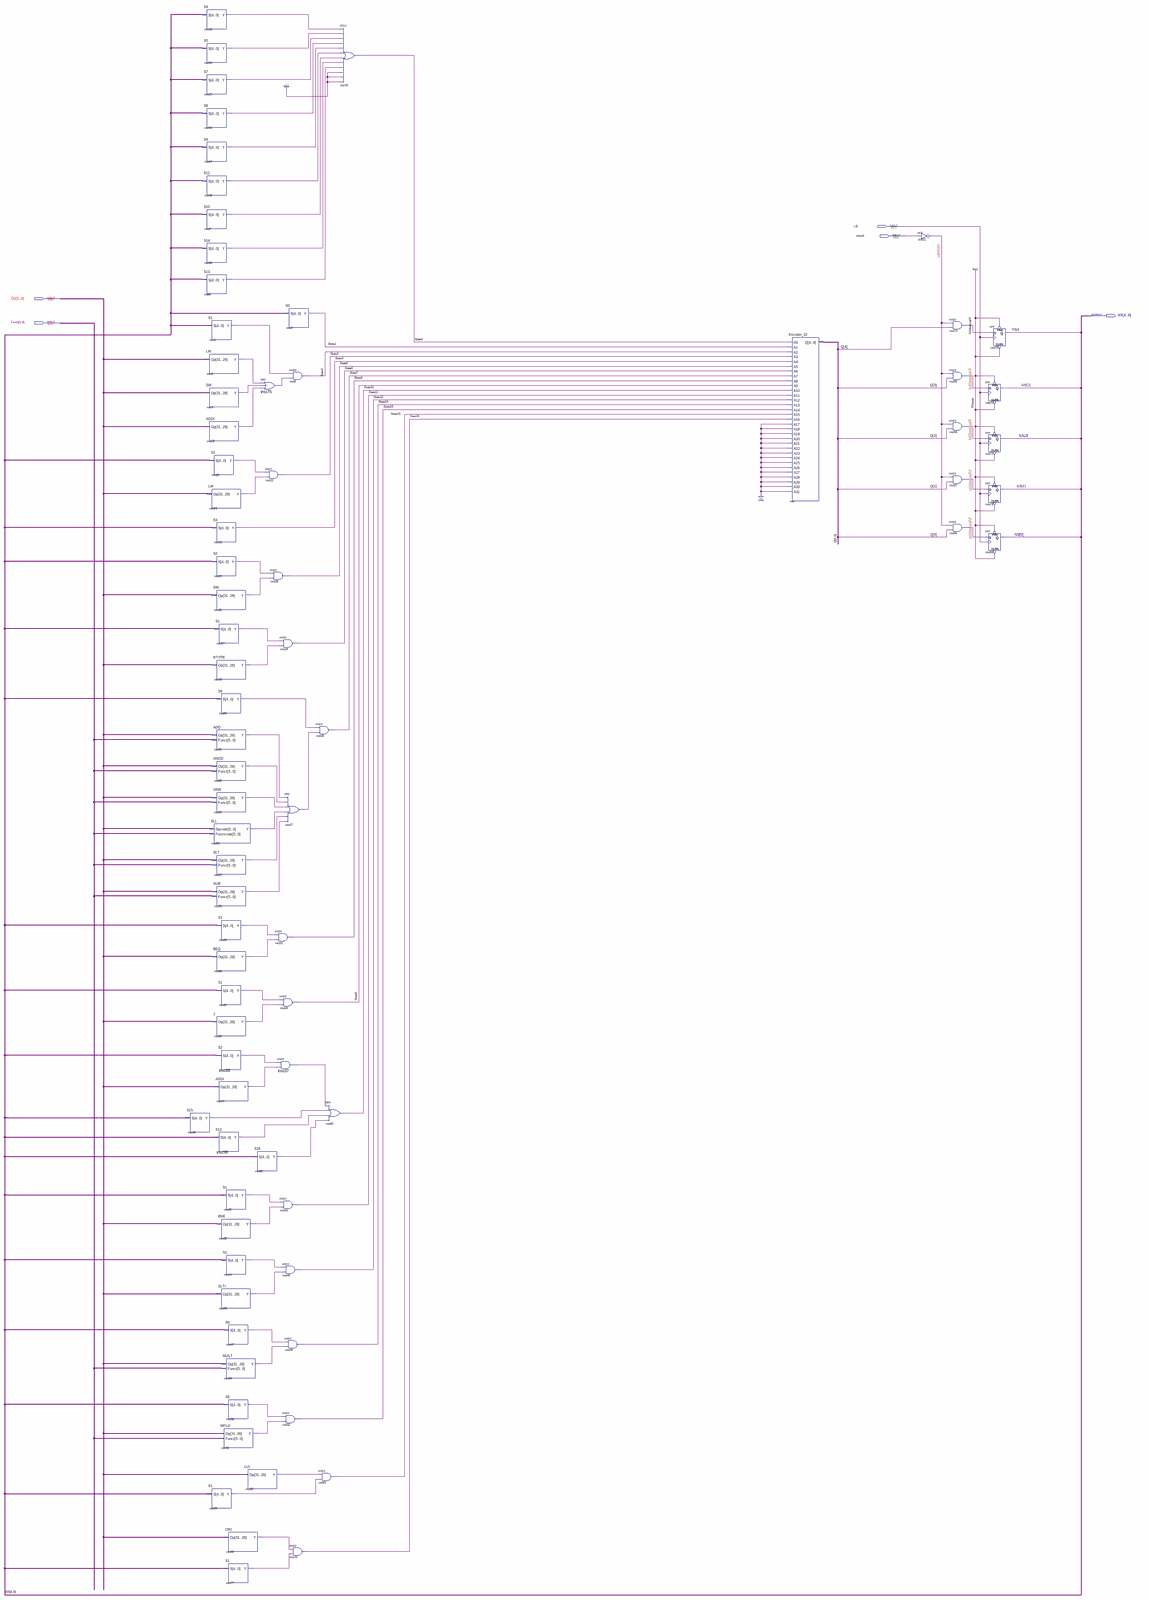
[diagram p0: schematic sheet, whole]
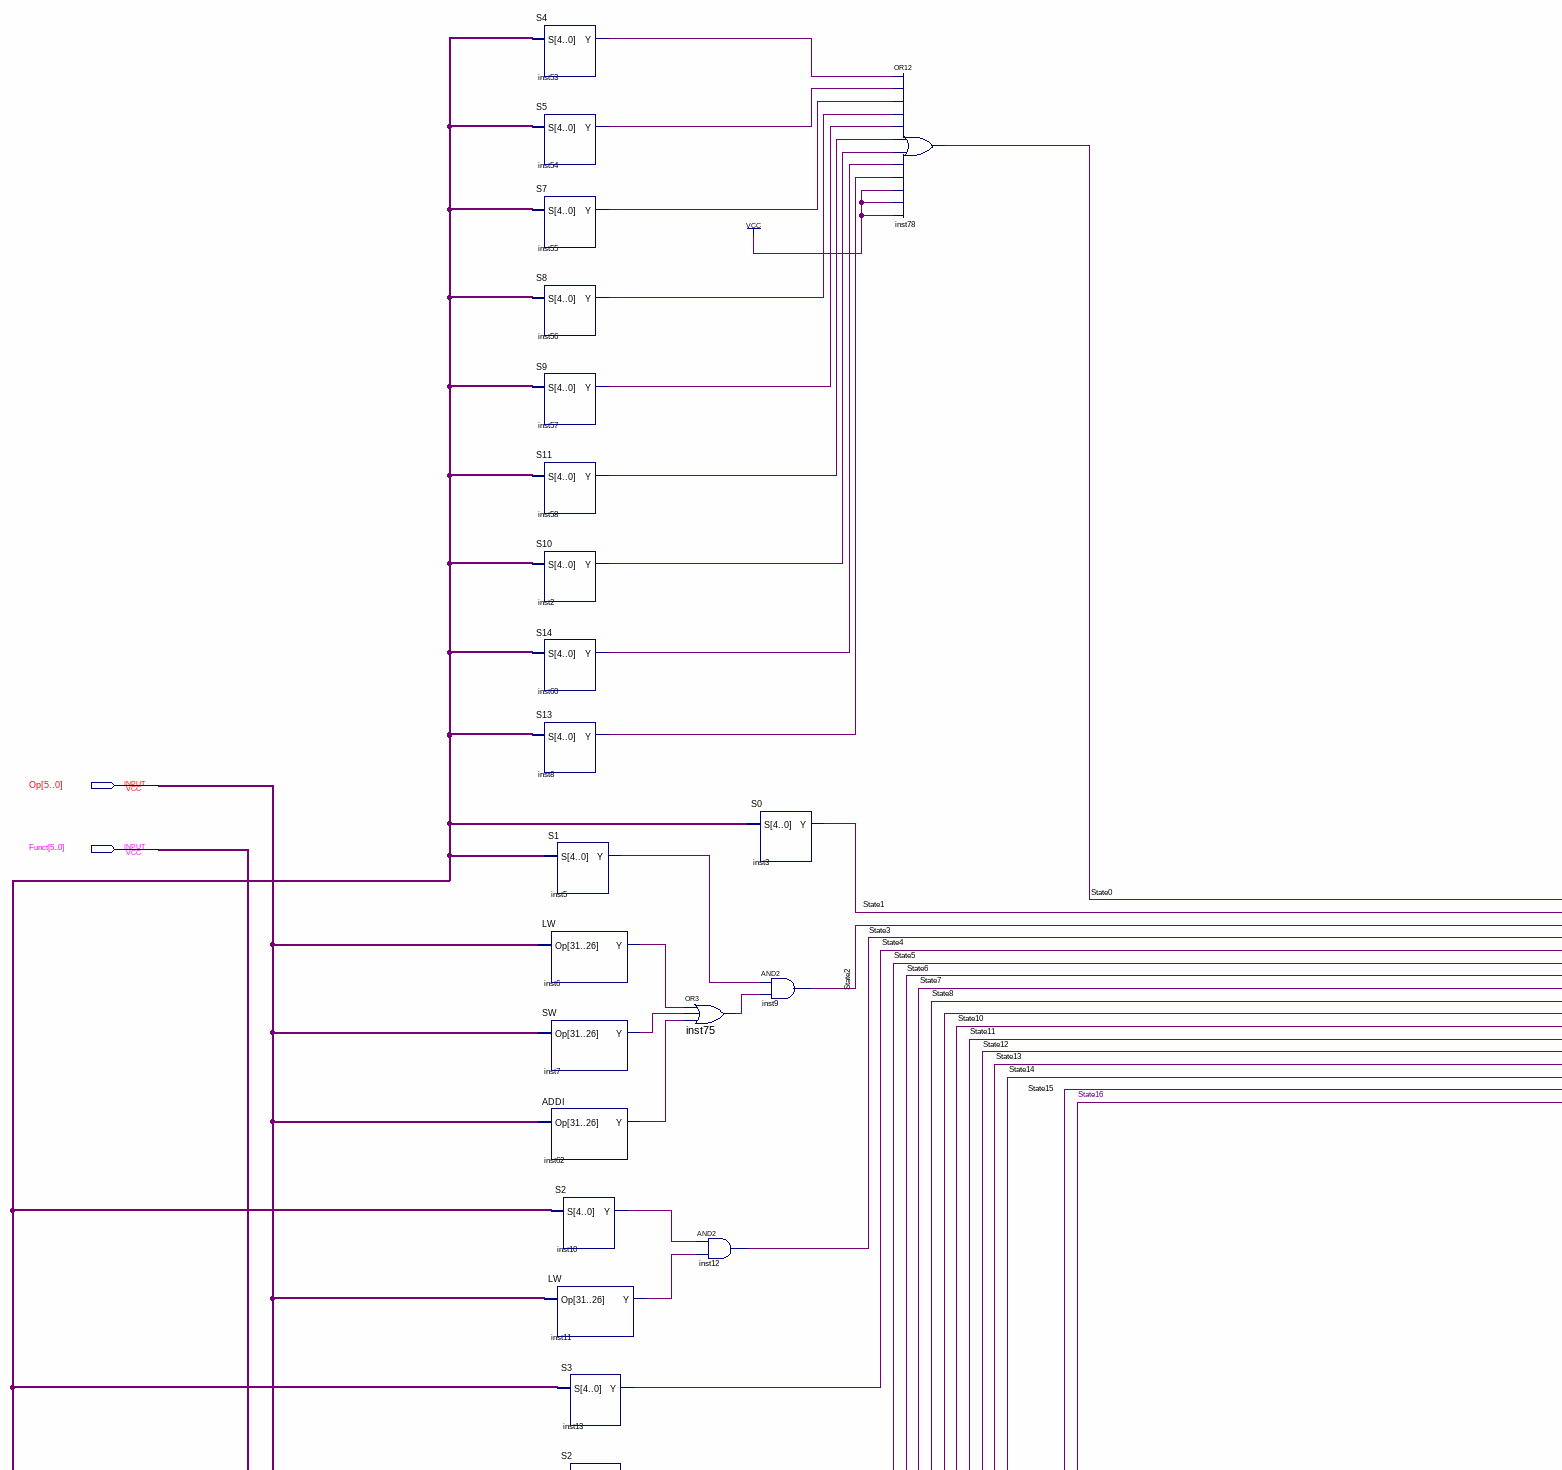
[diagram p1: schematic sheet, upper left part]
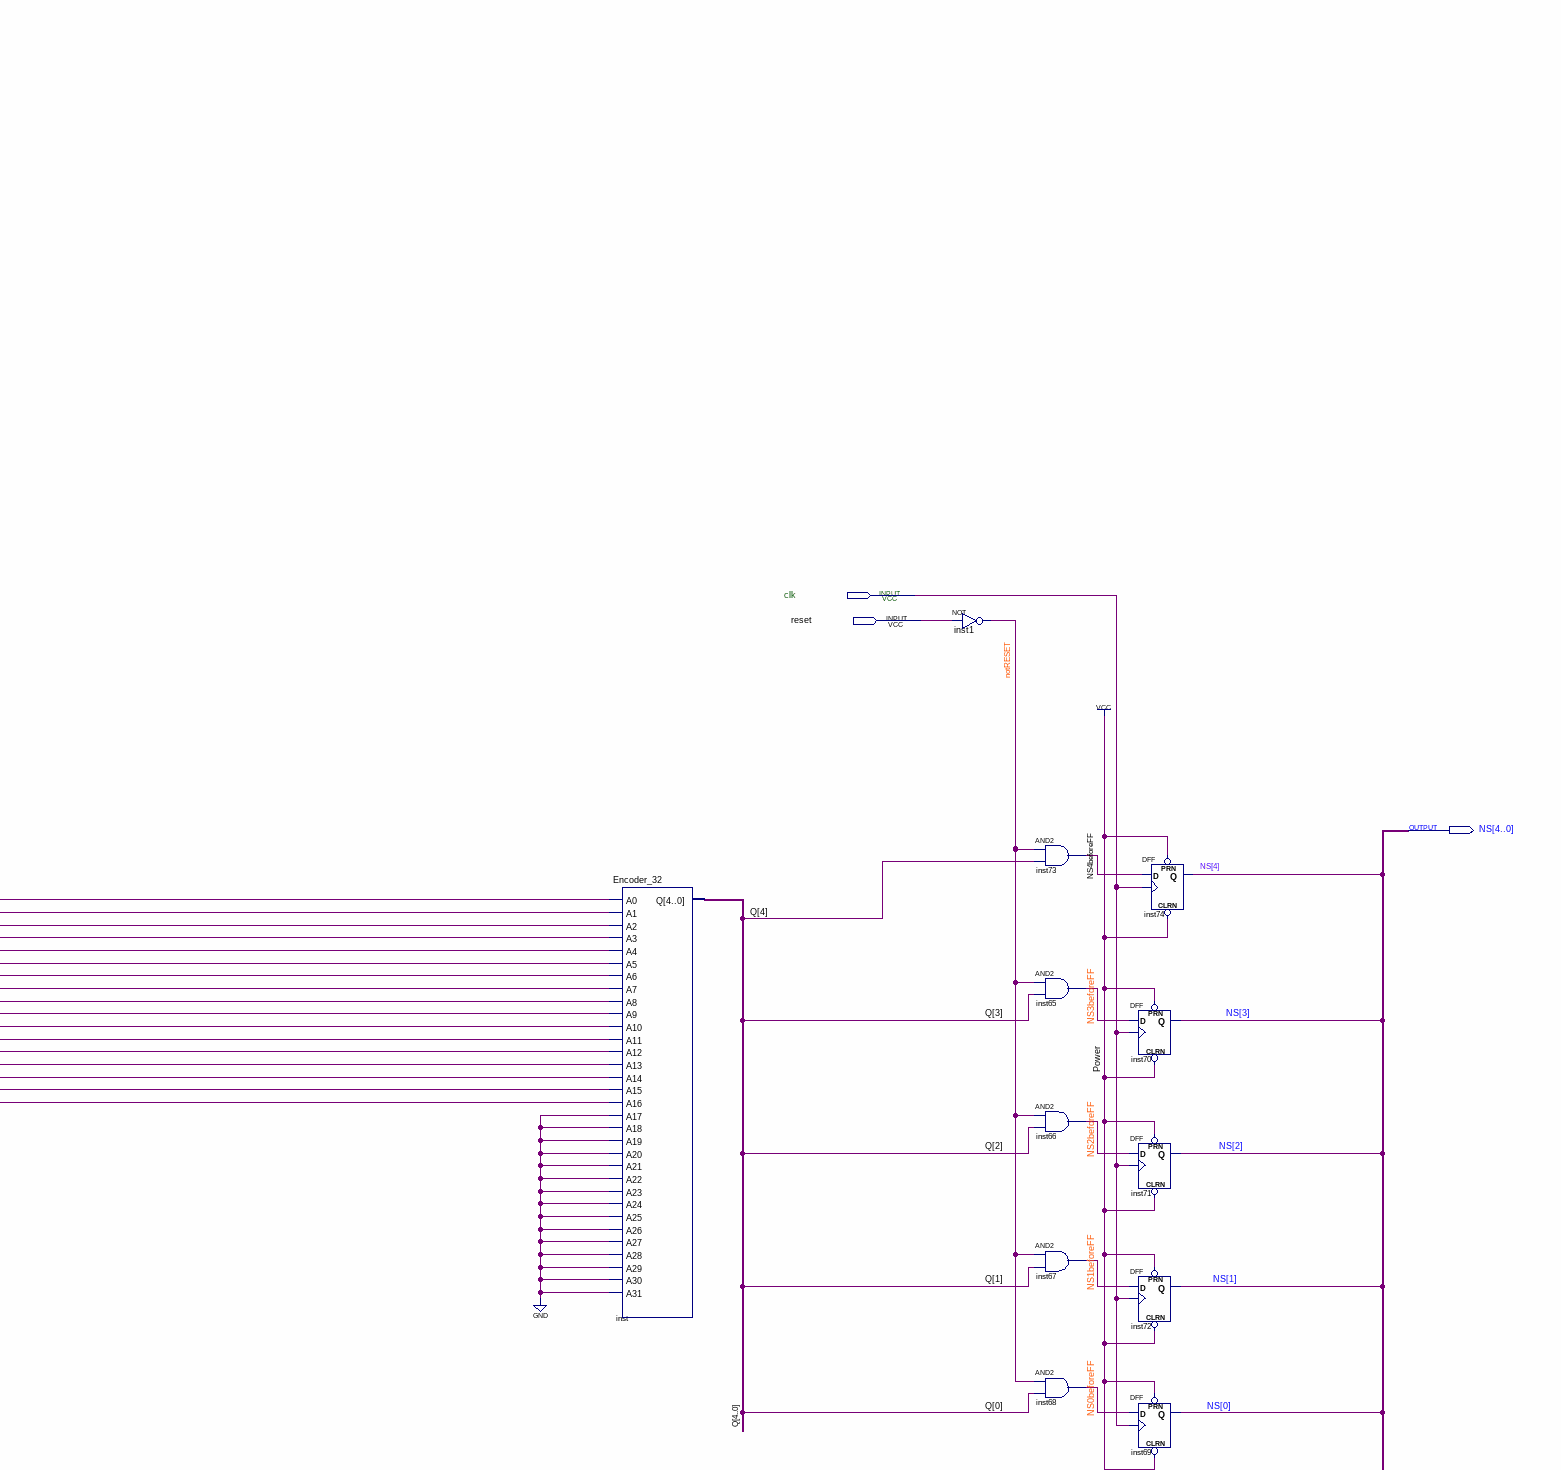
[diagram p2: schematic sheet, upper right part]
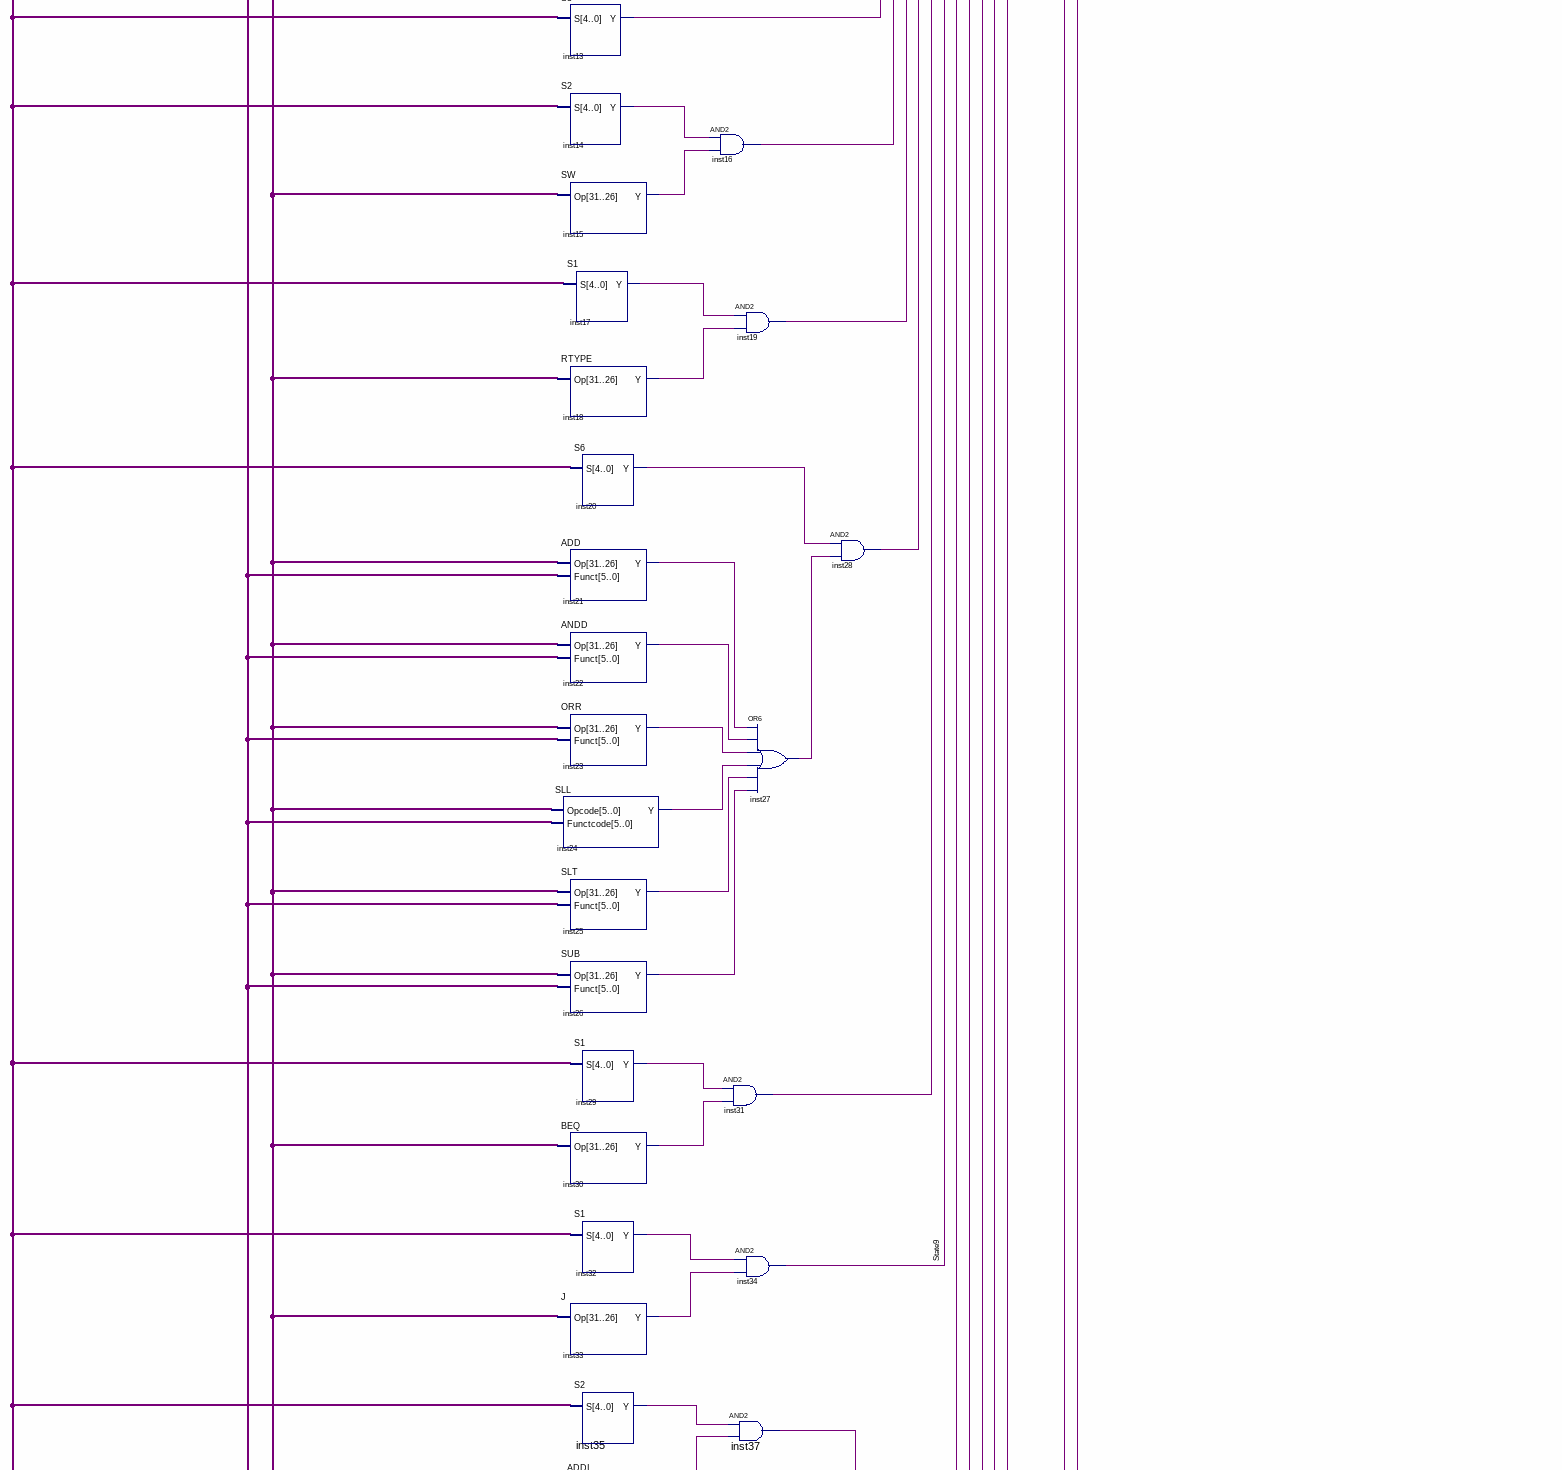
[diagram p3: schematic sheet, middle left part]
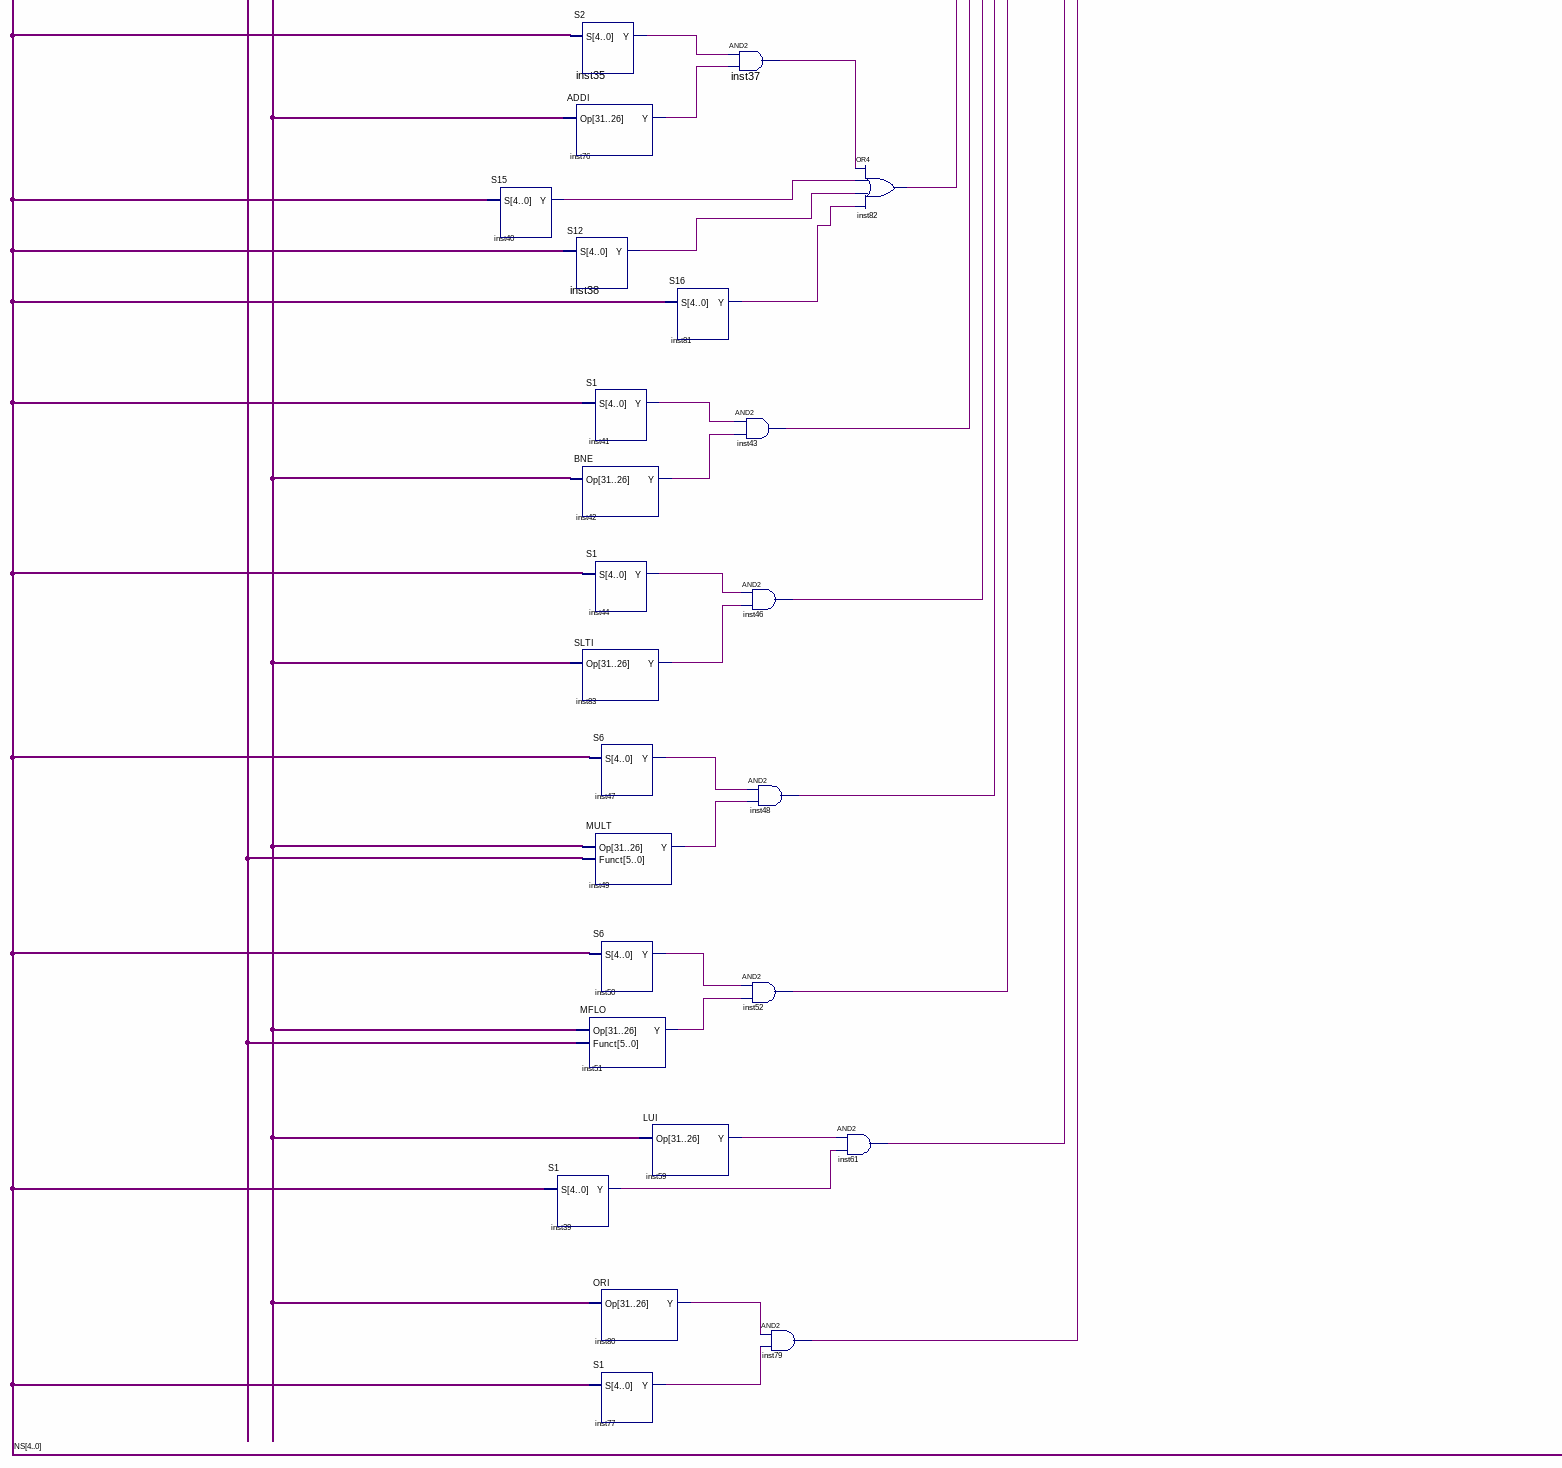
[diagram p4: schematic sheet, lower left part]
// Quartus schematic FSM.bdf as structural Verilog: 79 symbols, 5 pins
module FSM (
  input  clk,
  input  reset,
  input  [5:0] Op,
  input  [5:0] Funct,
  output [4:0] NS
);

  wire inst2_y, inst5_y, inst6_y, inst7_y, inst8_y, inst10_y, inst11_y, inst14_y, inst15_y, inst17_y,
       inst18_y, inst20_y, inst21_y, inst22_y, inst23_y, inst24_y, inst25_y, inst26_y, inst27_out, inst29_y,
       inst30_y, inst32_y, inst33_y, inst35_y, inst37_out, inst38_y, inst39_y, inst40_y, inst41_y, inst42_y,
       inst44_y, inst47_y, inst49_y, inst50_y, inst51_y, inst53_y, inst54_y, inst55_y, inst56_y, inst57_y,
       inst58_y, inst59_y, inst60_y, inst62_y, inst75_out, inst76_y, inst77_y, inst79_out, inst80_y,
       inst81_y, inst83_y, notRESET, NS0beforeFF, NS1beforeFF, NS2beforeFF, NS3beforeFF, NS4beforeFF, State0,
       State1, State2, State3, State4, State5, State6, State7, State8, State9, State10, State11, State12,
       State13, State14, State15;
  wire [4:0] Q;

  S15 inst40 (.S(NS), .Y(inst40_y));
  S4 inst53 (.S(NS), .Y(inst53_y));
  S5 inst54 (.S(NS), .Y(inst54_y));
  S7 inst55 (.S(NS), .Y(inst55_y));
  S8 inst56 (.S(NS), .Y(inst56_y));
  S9 inst57 (.S(NS), .Y(inst57_y));
  S11 inst58 (.S(NS), .Y(inst58_y));
  S10 inst2 (.S(NS), .Y(inst2_y));
  S14 inst60 (.S(NS), .Y(inst60_y));
  S13 inst8 (.S(NS), .Y(inst8_y));
  S1 inst5 (.S(NS), .Y(inst5_y));
  LW inst6 (.Op(Op), .Y(inst6_y));
  SW inst7 (.Op(Op), .Y(inst7_y));
  ADDI inst62 (.Op(Op), .Y(inst62_y));
  LW inst11 (.Op(Op), .Y(inst11_y));
  S1 inst39 (.S(NS), .Y(inst39_y));
  S2 inst10 (.S(NS), .Y(inst10_y));
  S3 inst13 (.S(NS), .Y(State4));
  S2 inst14 (.S(NS), .Y(inst14_y));
  SW inst15 (.Op(Op), .Y(inst15_y));
  S1 inst17 (.S(NS), .Y(inst17_y));
  RTYPE inst18 (.Op(Op), .Y(inst18_y));
  S6 inst20 (.S(NS), .Y(inst20_y));
  ADD inst21 (.Op(Op), .Funct(Funct), .Y(inst21_y));
  ANDD inst22 (.Op(Op), .Funct(Funct), .Y(inst22_y));
  ORR inst23 (.Op(Op), .Funct(Funct), .Y(inst23_y));
  SLL inst24 (.Opcode(Op), .Functcode(Funct), .Y(inst24_y));
  SLT inst25 (.Op(Op), .Funct(Funct), .Y(inst25_y));
  SUB inst26 (.Op(Op), .Funct(Funct), .Y(inst26_y));
  S1 inst29 (.S(NS), .Y(inst29_y));
  BEQ inst30 (.Op(Op), .Y(inst30_y));
  S1 inst32 (.S(NS), .Y(inst32_y));
  J inst33 (.Op(Op), .Y(inst33_y));
  S2 inst35 (.S(NS), .Y(inst35_y));
  ADDI inst76 (.Op(Op), .Y(inst76_y));
  S12 inst38 (.S(NS), .Y(inst38_y));
  S1 inst41 (.S(NS), .Y(inst41_y));
  BNE inst42 (.Op(Op), .Y(inst42_y));
  S1 inst44 (.S(NS), .Y(inst44_y));
  SLTI inst83 (.Op(Op), .Y(inst83_y));
  S6 inst47 (.S(NS), .Y(inst47_y));
  MULT inst49 (.Op(Op), .Funct(Funct), .Y(inst49_y));
  S6 inst50 (.S(NS), .Y(inst50_y));
  MFLO inst51 (.Op(Op), .Funct(Funct), .Y(inst51_y));
  ORI inst80 (.Op(Op), .Y(inst80_y));
  S1 inst77 (.S(NS), .Y(inst77_y));
  LUI inst59 (.Op(Op), .Y(inst59_y));
  or inst75 (inst75_out, inst6_y, inst7_y, inst62_y);
  and inst12 (State3, inst10_y, inst11_y);
  S16 inst81 (.S(NS), .Y(inst81_y));
  S0 inst3 (.S(NS), .Y(State1));
  and inst16 (State5, inst14_y, inst15_y);
  and inst19 (State6, inst17_y, inst18_y);
  or inst27 (inst27_out, inst21_y, inst22_y, inst23_y, inst24_y, inst25_y, inst26_y);
  and inst31 (State8, inst29_y, inst30_y);
  and inst34 (State9, inst32_y, inst33_y);
  and inst37 (inst37_out, inst35_y, inst76_y);
  and inst43 (State11, inst41_y, inst42_y);
  and inst46 (State12, inst44_y, inst83_y);
  and inst48 (State13, inst47_y, inst49_y);
  and inst52 (State14, inst50_y, inst51_y);
  and inst9 (State2, inst5_y, inst75_out);
  and inst79 (inst79_out, inst80_y, inst77_y);
  and inst28 (State7, inst20_y, inst27_out);
  and inst61 (State15, inst59_y, inst39_y);
  or inst78 (State0, inst53_y, inst54_y, inst55_y, inst56_y, inst57_y, inst58_y, inst2_y, inst60_y, inst8_y, 1'b1, 1'b1, 1'b1);
  or inst82 (State10, inst37_out, inst40_y, inst38_y, inst81_y);
  Encoder_32 inst (
    .A0(State0), .A1(State1), .A2(State2), .A3(State3), .A4(State4), .A5(State5), .A6(State6), .A7(State7),
    .A8(State8), .A9(State9), .A10(State10), .A11(State11), .A12(State12), .A13(State13), .A14(State14),
    .A15(State15), .A16(inst79_out), .A17(1'b0), .A18(1'b0), .A19(1'b0), .A20(1'b0), .A21(1'b0), .A22(1'b0),
    .A23(1'b0), .A24(1'b0), .A25(1'b0), .A26(1'b0), .A27(1'b0), .A28(1'b0), .A29(1'b0), .A30(1'b0),
    .A31(1'b0), .Q(Q));
  not inst1 (notRESET, reset);
  and inst73 (NS4beforeFF, notRESET, Q[4]);
  and inst65 (NS3beforeFF, notRESET, Q[3]);
  and inst66 (NS2beforeFF, notRESET, Q[2]);
  and inst67 (NS1beforeFF, notRESET, Q[1]);
  and inst68 (NS0beforeFF, notRESET, Q[0]);
  DFF inst74 (.CLRN(1'b1), .CLK(clk), .D(NS4beforeFF), .PRN(1'b1), .Q(NS[4]));
  DFF inst70 (.CLRN(1'b1), .CLK(clk), .D(NS3beforeFF), .PRN(1'b1), .Q(NS[3]));
  DFF inst71 (.CLRN(1'b1), .CLK(clk), .D(NS2beforeFF), .PRN(1'b1), .Q(NS[2]));
  DFF inst72 (.CLRN(1'b1), .CLK(clk), .D(NS1beforeFF), .PRN(1'b1), .Q(NS[1]));
  DFF inst69 (.CLRN(1'b1), .CLK(clk), .D(NS0beforeFF), .PRN(1'b1), .Q(NS[0]));

  // Notes on the sheet:
  //   State16
endmodule
